# EAGLE design new_PowerBoard (EAGLE 5.11)
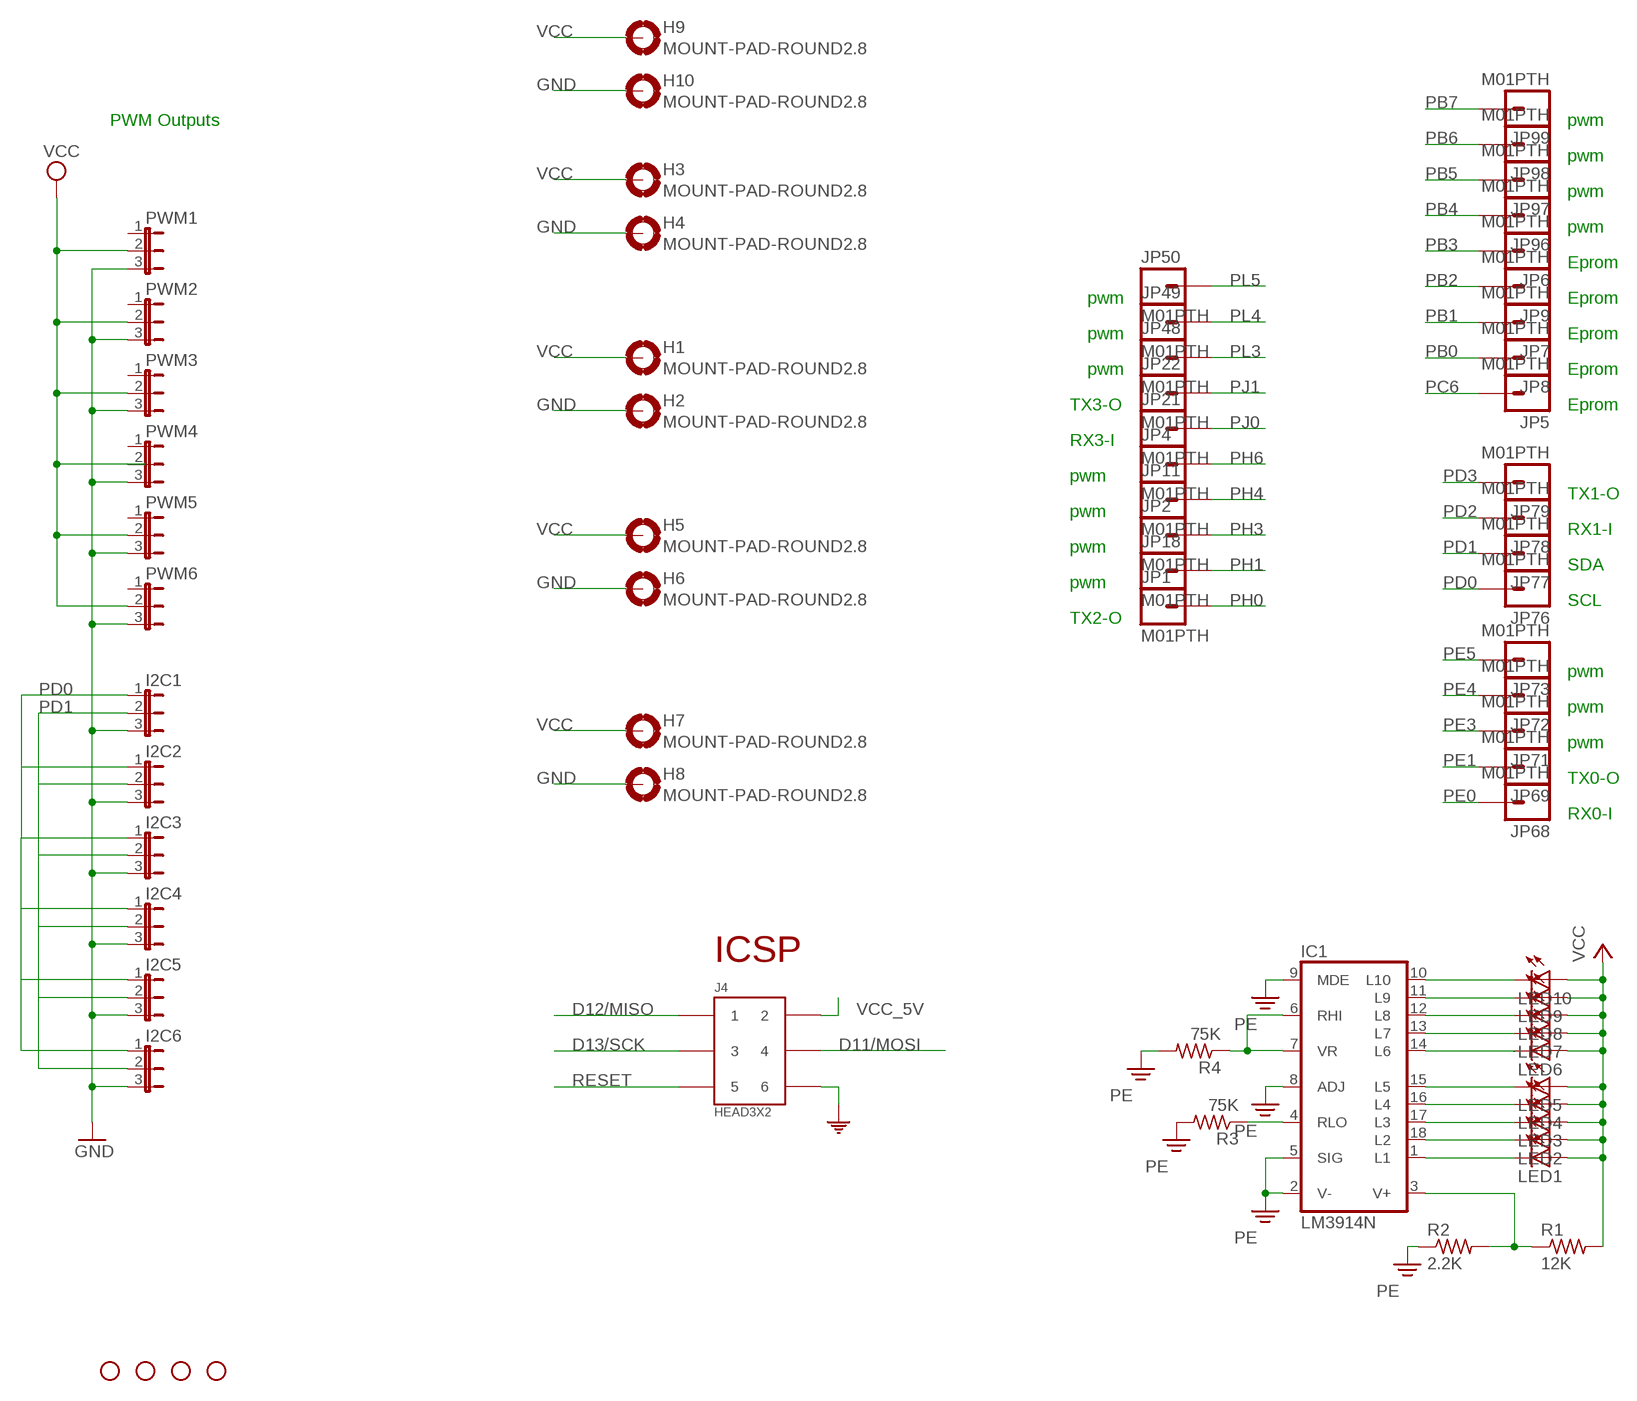
[diagram p0: schematic, sheet 1]

## Parts
H1  MOUNT-PAD-ROUND2.8  [2,8-PAD]
H2  MOUNT-PAD-ROUND2.8  [2,8-PAD]
H3  MOUNT-PAD-ROUND2.8  [2,8-PAD]
H4  MOUNT-PAD-ROUND2.8  [2,8-PAD]
H5  MOUNT-PAD-ROUND2.8  [2,8-PAD]
H6  MOUNT-PAD-ROUND2.8  [2,8-PAD]
H7  MOUNT-PAD-ROUND2.8  [2,8-PAD]
H8  MOUNT-PAD-ROUND2.8  [2,8-PAD]
H9  MOUNT-PAD-ROUND2.8  [2,8-PAD]
H10  MOUNT-PAD-ROUND2.8  [2,8-PAD]
I2C1  JP2E  [JP2]
I2C2  JP2E  [JP2]
I2C3  JP2E  [JP2]
I2C4  JP2E  [JP2]
I2C5  JP2E  [JP2]
I2C6  JP2E  [JP2]
IC1  LM3914N  [DIL18]
J4  HEAD3X2  [HEAD3X2]
JP1  M01PTH  [1X01]
JP2  M01PTH  [1X01]
JP4  M01PTH  [1X01]
JP5  M01PTH  [1X01]
JP6  M01PTH  [1X01]
JP7  M01PTH  [1X01]
JP8  M01PTH  [1X01]
JP9  M01PTH  [1X01]
JP11  M01PTH  [1X01]
JP12  STAND-OFF  [STAND-OFF]
JP13  STAND-OFF  [STAND-OFF]
JP14  STAND-OFF  [STAND-OFF]
JP15  STAND-OFF  [STAND-OFF]
JP18  M01PTH  [1X01]
JP21  M01PTH  [1X01]
JP22  M01PTH  [1X01]
JP48  M01PTH  [1X01]
JP49  M01PTH  [1X01]
JP50  M01PTH  [1X01]
JP68  M01PTH  [1X01]
JP69  M01PTH  [1X01]
JP71  M01PTH  [1X01]
JP72  M01PTH  [1X01]
JP73  M01PTH  [1X01]
JP76  M01PTH  [1X01]
JP77  M01PTH  [1X01]
JP78  M01PTH  [1X01]
JP79  M01PTH  [1X01]
JP96  M01PTH  [1X01]
JP97  M01PTH  [1X01]
JP98  M01PTH  [1X01]
JP99  M01PTH  [1X01]
LED1  LEDSMT1206  [1206]
LED2  LEDSMT1206  [1206]
LED3  LEDSMT1206  [1206]
LED4  LEDSMT1206  [1206]
LED5  LEDSMT1206  [1206]
LED6  LEDSMT1206  [1206]
LED7  LEDSMT1206  [1206]
LED8  LEDSMT1206  [1206]
LED9  LEDSMT1206  [1206]
LED10  LEDSMT1206  [1206]
PWM1  JP2E  [JP2]
PWM2  JP2E  [JP2]
PWM3  JP2E  [JP2]
PWM4  JP2E  [JP2]
PWM5  JP2E  [JP2]
PWM6  JP2E  [JP2]
R1  12K  R-US_R0805  [R0805]
R2  2.2K  R-US_R0805  [R0805]
R3  75K  R-US_R0805  [R0805]
R4  75K  R-US_R0805  [R0805]

## Nets
D11/MOSI: J4.4
D12/MISO: J4.1
D13/SCK: J4.3
GND: H2.B2,8(MOUNT) H4.B2,8(MOUNT) H6.B2,8(MOUNT) H8.B2,8(MOUNT) H10.B2,8(MOUNT) I2C1.3 I2C2.3 I2C3.3 I2C4.3 I2C5.3 I2C6.3 J4.6 PWM1.3 PWM2.3 PWM3.3 PWM4.3 PWM5.3 PWM6.3 ; supply symbol labelled COM
N$1: IC1.3(V+) R1.1 R2.2
N$2: IC1.10(L10) LED10.C
N$3: IC1.11(L9) LED9.C
N$4: IC1.12(L8) LED8.C
N$5: IC1.13(L7) LED7.C
N$7: IC1.14(L6) LED6.C
N$8: IC1.15(L5) LED5.C
N$9: IC1.16(L4) LED4.C
N$10: IC1.17(L3) LED3.C
N$11: IC1.18(L2) LED2.C
N$12: IC1.1(L1) LED1.C
N$14: IC1.4(RLO) R3.1
N$15: IC1.6(RHI) IC1.7(VR) R4.1
PB0: JP8.1
PB1: JP7.1
PB2: JP9.1
PB3: JP6.1
PB4: JP96.1
PB5: JP97.1
PB6: JP98.1
PB7: JP99.1
PC6: JP5.1
PD0: I2C1.1 I2C2.1 I2C3.1 I2C4.1 I2C5.1 I2C6.1 JP76.1
PD1: I2C1.2 I2C2.2 I2C3.2 I2C4.2 I2C5.2 I2C6.2 JP77.1
PD2: JP78.1
PD3: JP79.1
PE: IC1.2(V-) IC1.5(SIG) IC1.8(ADJ) IC1.9(MDE) R2.1 R3.2 R4.2
PE0: JP68.1
PE1: JP69.1
PE3: JP71.1
PE4: JP72.1
PE5: JP73.1
PH0: JP1.1
PH1: JP18.1
PH3: JP2.1
PH4: JP11.1
PH6: JP4.1
PJ0: JP21.1
PJ1: JP22.1
PL3: JP48.1
PL4: JP49.1
PL5: JP50.1
RESET: J4.5
VCC: H1.B2,8(MOUNT) H3.B2,8(MOUNT) H5.B2,8(MOUNT) H7.B2,8(MOUNT) H9.B2,8(MOUNT) LED1.A LED2.A LED3.A LED4.A LED5.A LED6.A LED7.A LED8.A LED9.A LED10.A PWM1.2 PWM2.2 PWM3.2 PWM5.2 PWM6.2 R1.2
VCC_5V: J4.2
Unconnected: PWM1.1 PWM2.1 PWM3.1 PWM4.1 PWM4.2 PWM5.1 PWM6.1

## Notes on the sheet
- PWM Outputs | pwm
- pwm
- pwm
- pwm
- Eprom
- pwm | Eprom
- pwm | Eprom
- pwm | Eprom
- TX3-O | Eprom
- RX3-I
- pwm
- TX1-O
- pwm
- RX1-I
- pwm
- SDA
- pwm
- SCL
- TX2-O
- pwm
- pwm
- pwm
- TX0-O
- RX0-I
- ICSP

## Library data of the parts
H1-H10 = holes:MOUNT-PAD-ROUND: MOUNTING PAD, round
I2C1-I2C6 PWM1-PWM6 = jumper:JP2E: JUMPER
IC1 = linear:LM3914N: LED DRIVER senses analog voltage levels and drives 10 LEDs
J4 = MyCON2:HEAD3X2
JP1 JP2 JP4-JP9 JP11 JP18 JP21 JP22 JP48-JP50 JP68 JP69 JP71-JP73 JP76-JP79 JP96-JP99 = DIYdrones3:M01: Header 1 Standard 1-pin 0.1" header. Use with straight break away headers (SKU : PRT-00116), right angle break away headers (PRT-00553), swiss pins (PRT-00743), machine pins (PRT-00117), and female headers (PRT-00115).
JP12-JP15 = SparkFun:STAND-OFF: Stand Off This is the mechanical footprint for a #4 phillips button head screw. Use the keepout ring to avoid running the screw head into surrounding components. SKU : PRT-00447
LED1-LED10 = led:LED: LED OSRAM: - CHIPLED LG R971, LG N971, LY N971, LG Q971, LY Q971, LO R971, LY R971 LH N974, LH R974 LS Q976, LO Q976, LY Q976 LO Q996 - Hyper CHIPLED LW Q18S LB Q993, LB Q99A, LB R99A - SideLED LS A670, LO A670, LY A670, LG A670, LP A670 LB A673, LV A673, LT A673, LW A673 LH A674 LY A675 LS A676, LA A676, LO A676, LY A676, LW A676 LS A679, LY A679, LG A679 - Hyper Micro SIDELED® LS Y876, LA Y876, LO Y876, LY Y876 LT Y87S - SmartLED LW L88C, LW L88S LB L89C, LB L89S, LG L890 LS L89K, LO L89K, LY L89K LS L896, LA L896, LO L896, LY L896 - TOPLED LS T670, LO T670, LY T670, LG T670, LP T670 LSG T670, LSP T670, LSY T670, LOP T670, LYG T670 LG T671, LOG T671, LSG T671 LB T673, LV T673, LT T673, LW T673 LH T674 LS T676, LA T676, LO T676, LY T676, LB T676, LH T676, LSB T676, LW T676 LB T67C, LV T67C, LT T67C, LS T67K, LO T67K, LY T67K, LW E67C LS E67B, LA E67B, LO E67B, LY E67B, LB E67C, LV E67C, LT E67C LW T67C LS T679, LY T679, LG T679 LS T770, LO T770, LY T770, LG T770, LP T770 LB T773, LV T773, LT T773, LW T773 LH T774 LS E675, LA E675, LY E675, LS T675 LS T776, LA T776, LO T776, LY T776, LB T776 LHGB T686 LT T68C, LB T68C - Hyper Mini TOPLED® LB M676 - Mini TOPLED Santana® LG M470 LS M47K, LO M47K, LY M47K Source: http://www.osram.convergy.de LUXEON: - LUMILED® LXK2-PW12-R00, LXK2-PW12-S00, LXK2-PW14-U00, LXK2-PW14-V00 LXK2-PM12-R00, LXK2-PM12-S00, LXK2-PM14-U00 LXK2-PE12-Q00, LXK2-PE12-R00, LXK2-PE12-S00, LXK2-PE14-T00, LXK2-PE14-U00 LXK2-PB12-K00, LXK2-PB12-L00, LXK2-PB12-M00, LXK2-PB14-N00, LXK2-PB14-P00, LXK2-PB14-Q00 LXK2-PR12-L00, LXK2-PR12-M00, LXK2-PR14-Q00, LXK2-PR14-R00 LXK2-PD12-Q00, LXK2-PD12-R00, LXK2-PD12-S00 LXK2-PH12-R00, LXK2-PH12-S00 LXK2-PL12-P00, LXK2-PL12-Q00, LXK2-PL12-R00 Source: www.luxeon.com KINGBRIGHT: KA-3528ASYC Source: www.kingbright.com
R1-R4 = resistor:R-US_: RESISTOR, American symbol

## Board
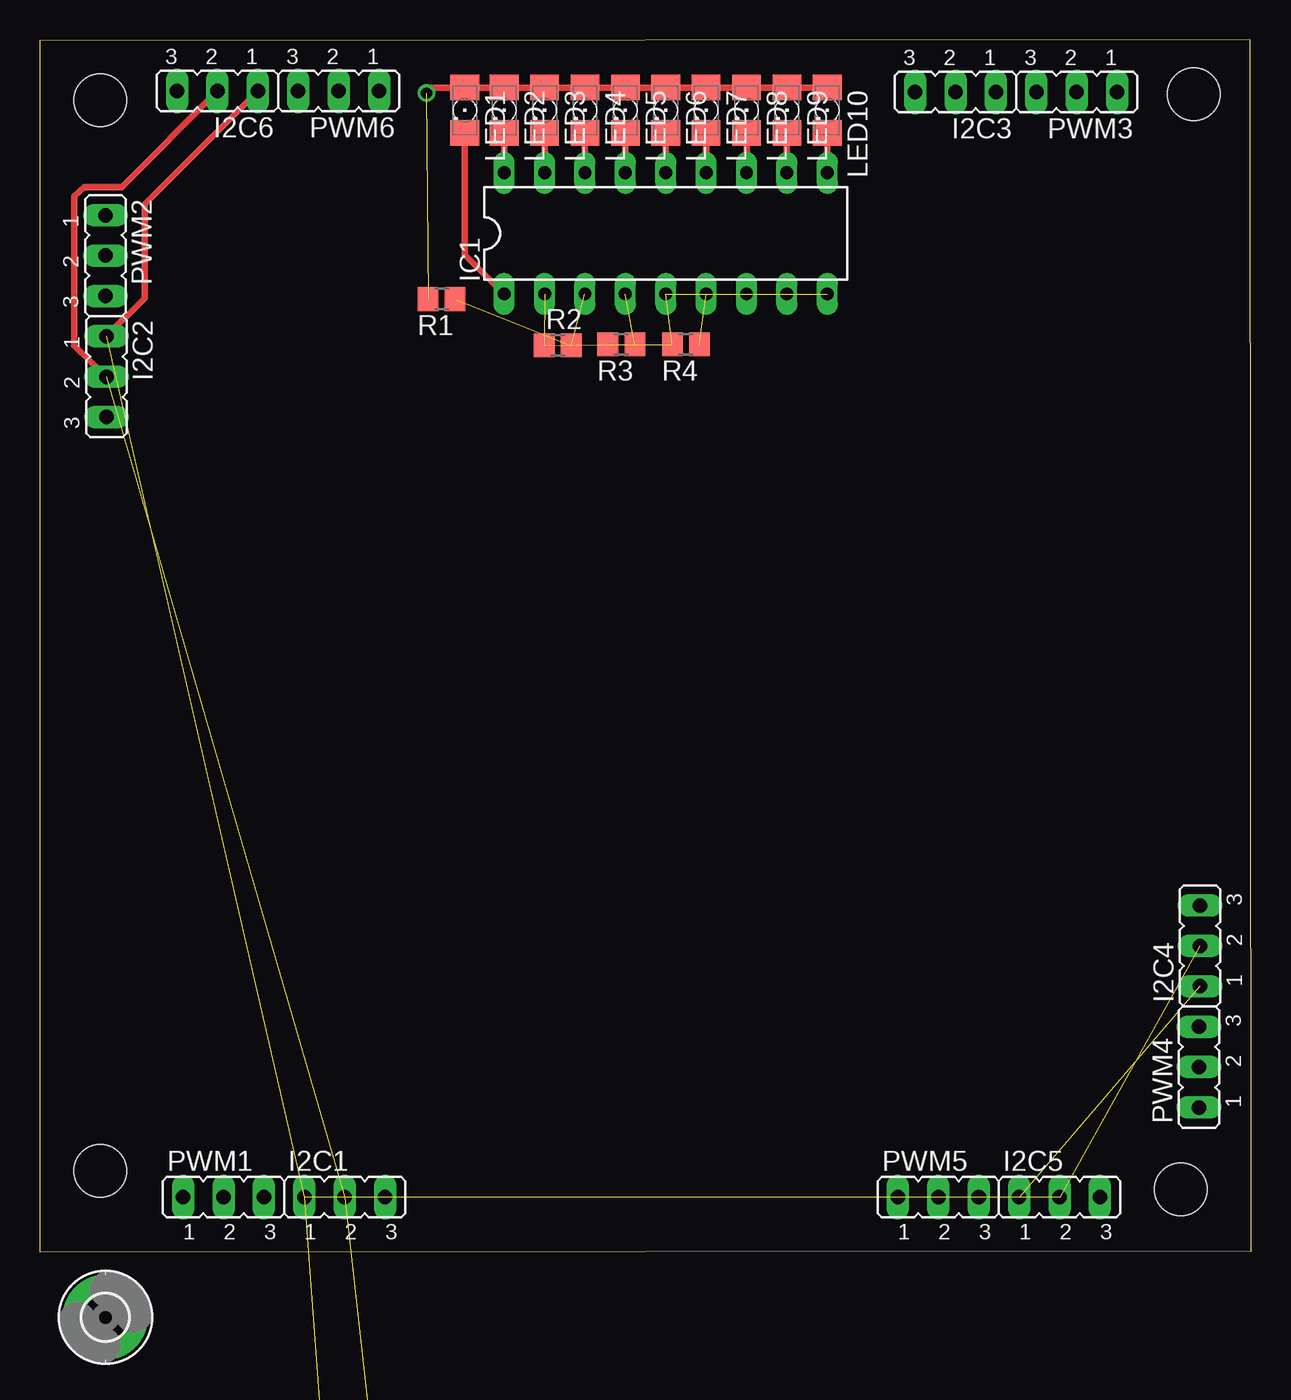
[diagram p1: board, top side]
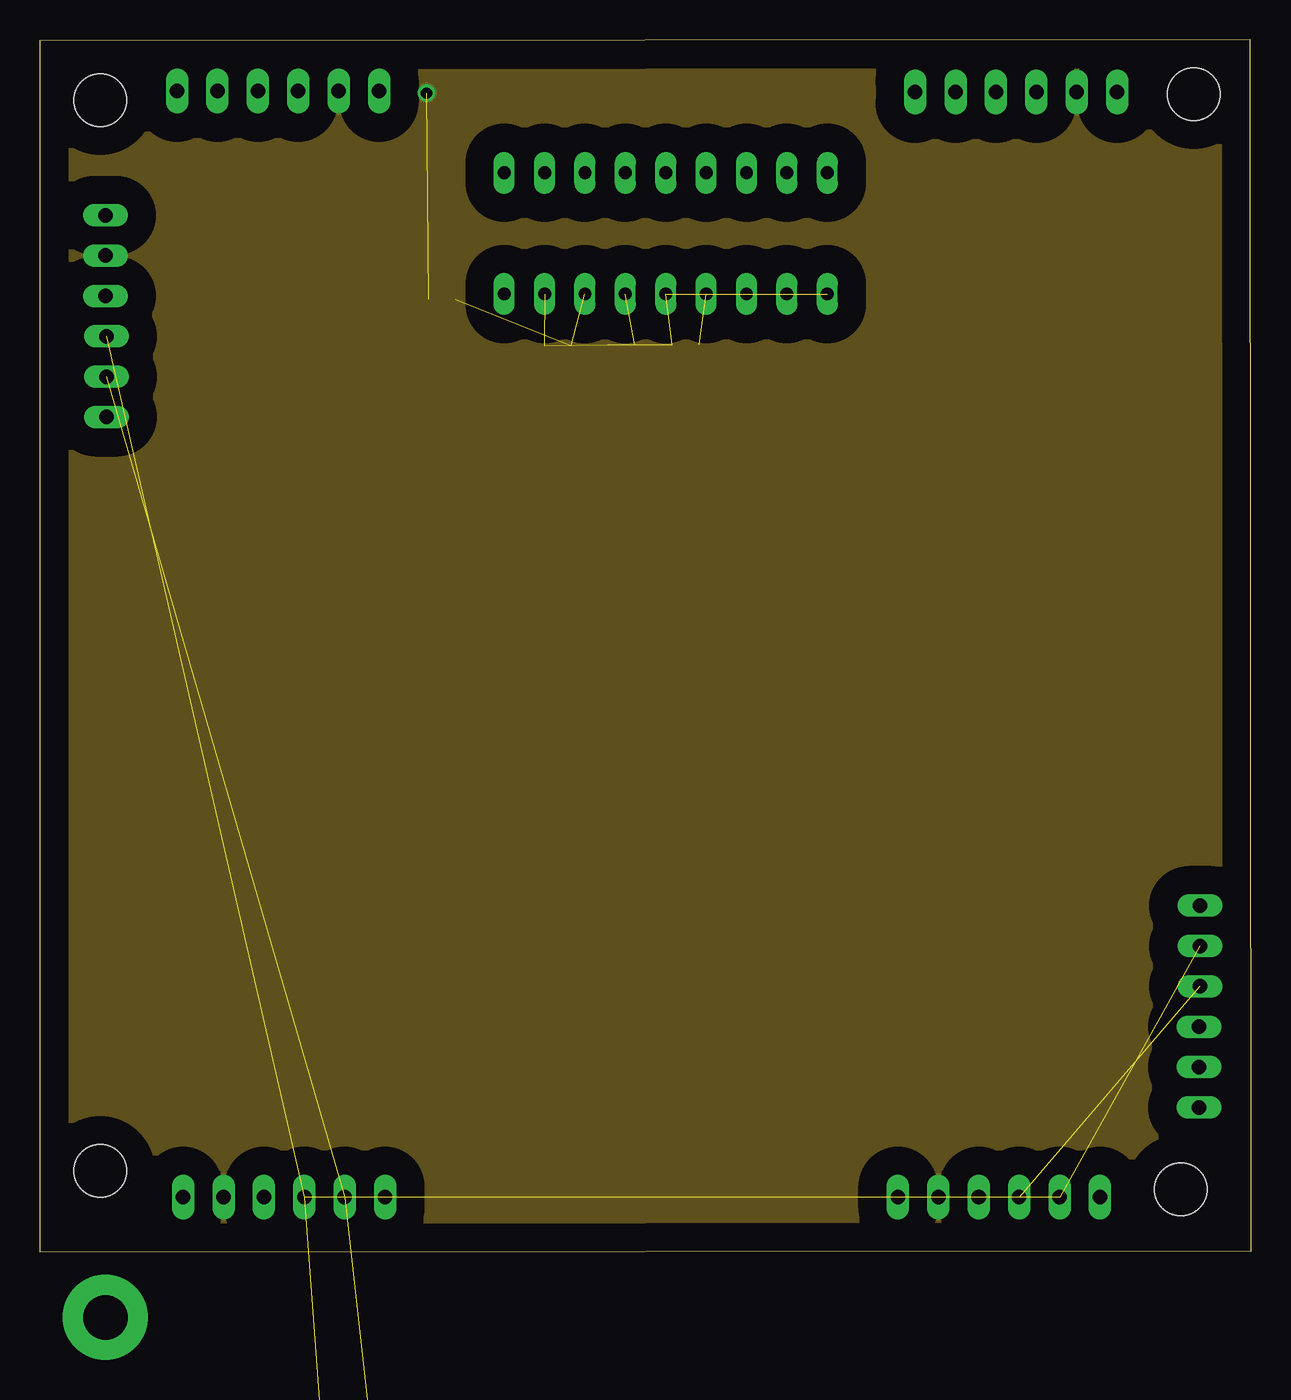
[diagram p2: board, inner layer $vcc]
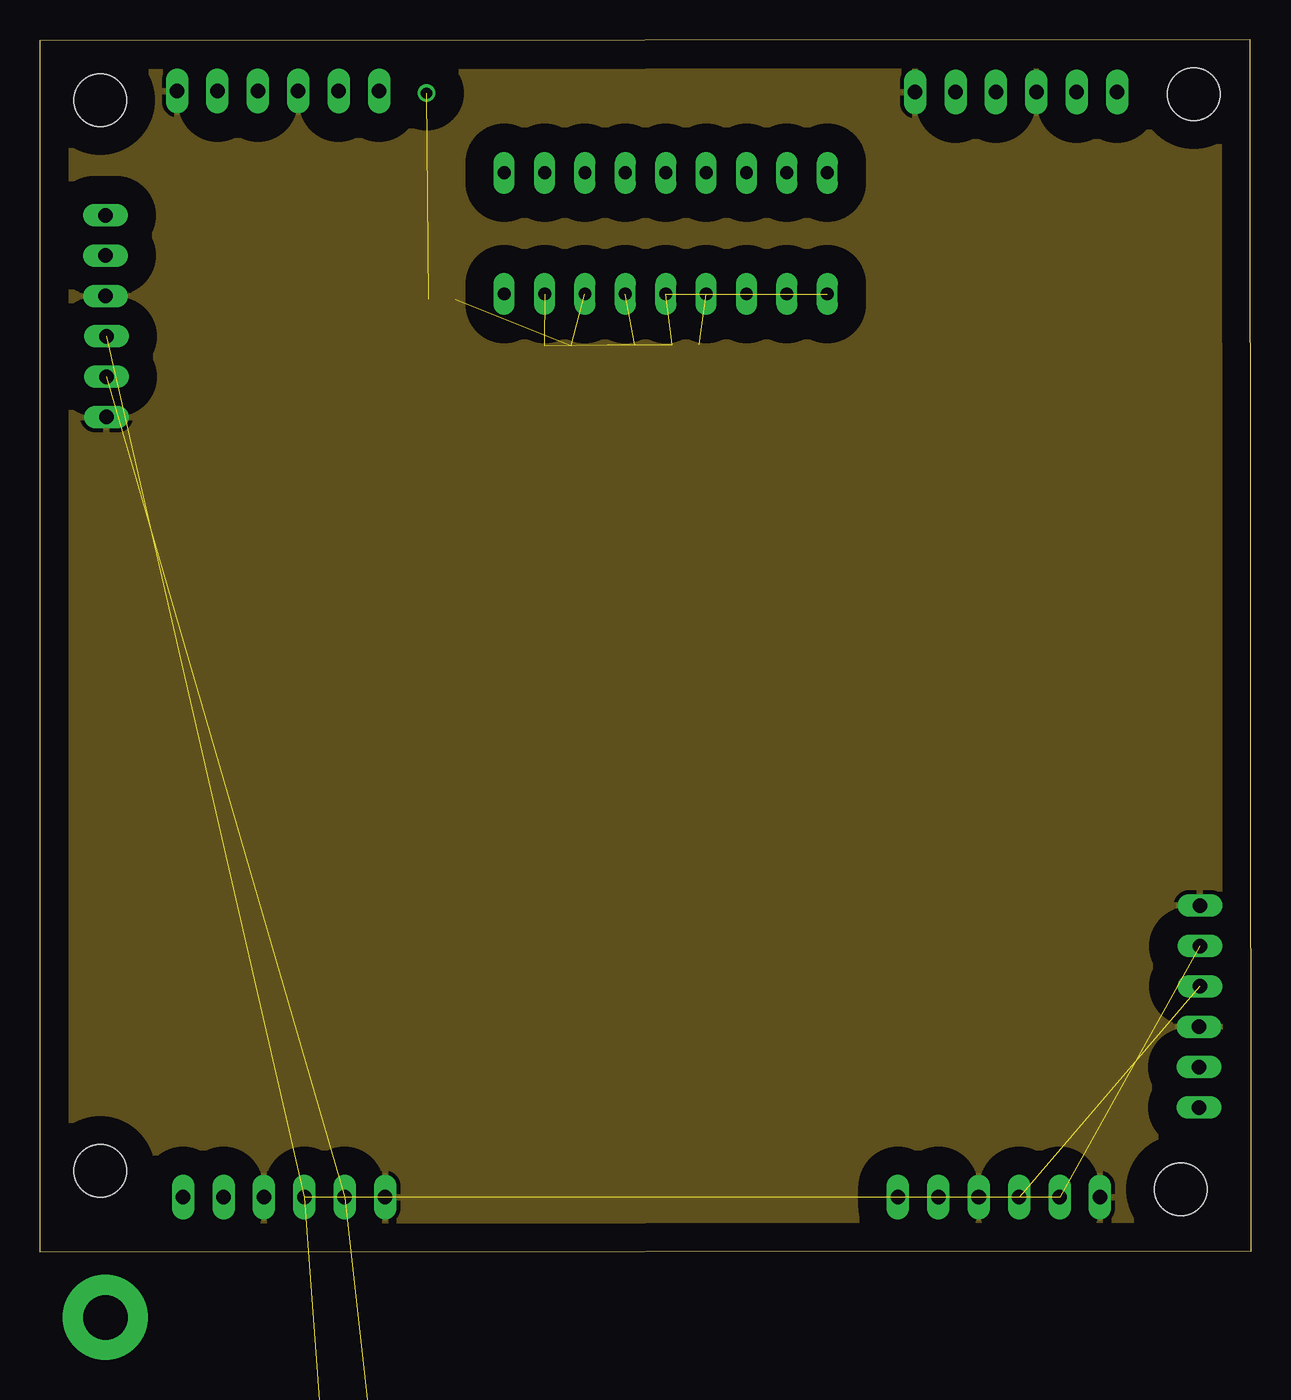
[diagram p3: board, inner layer $gnd]
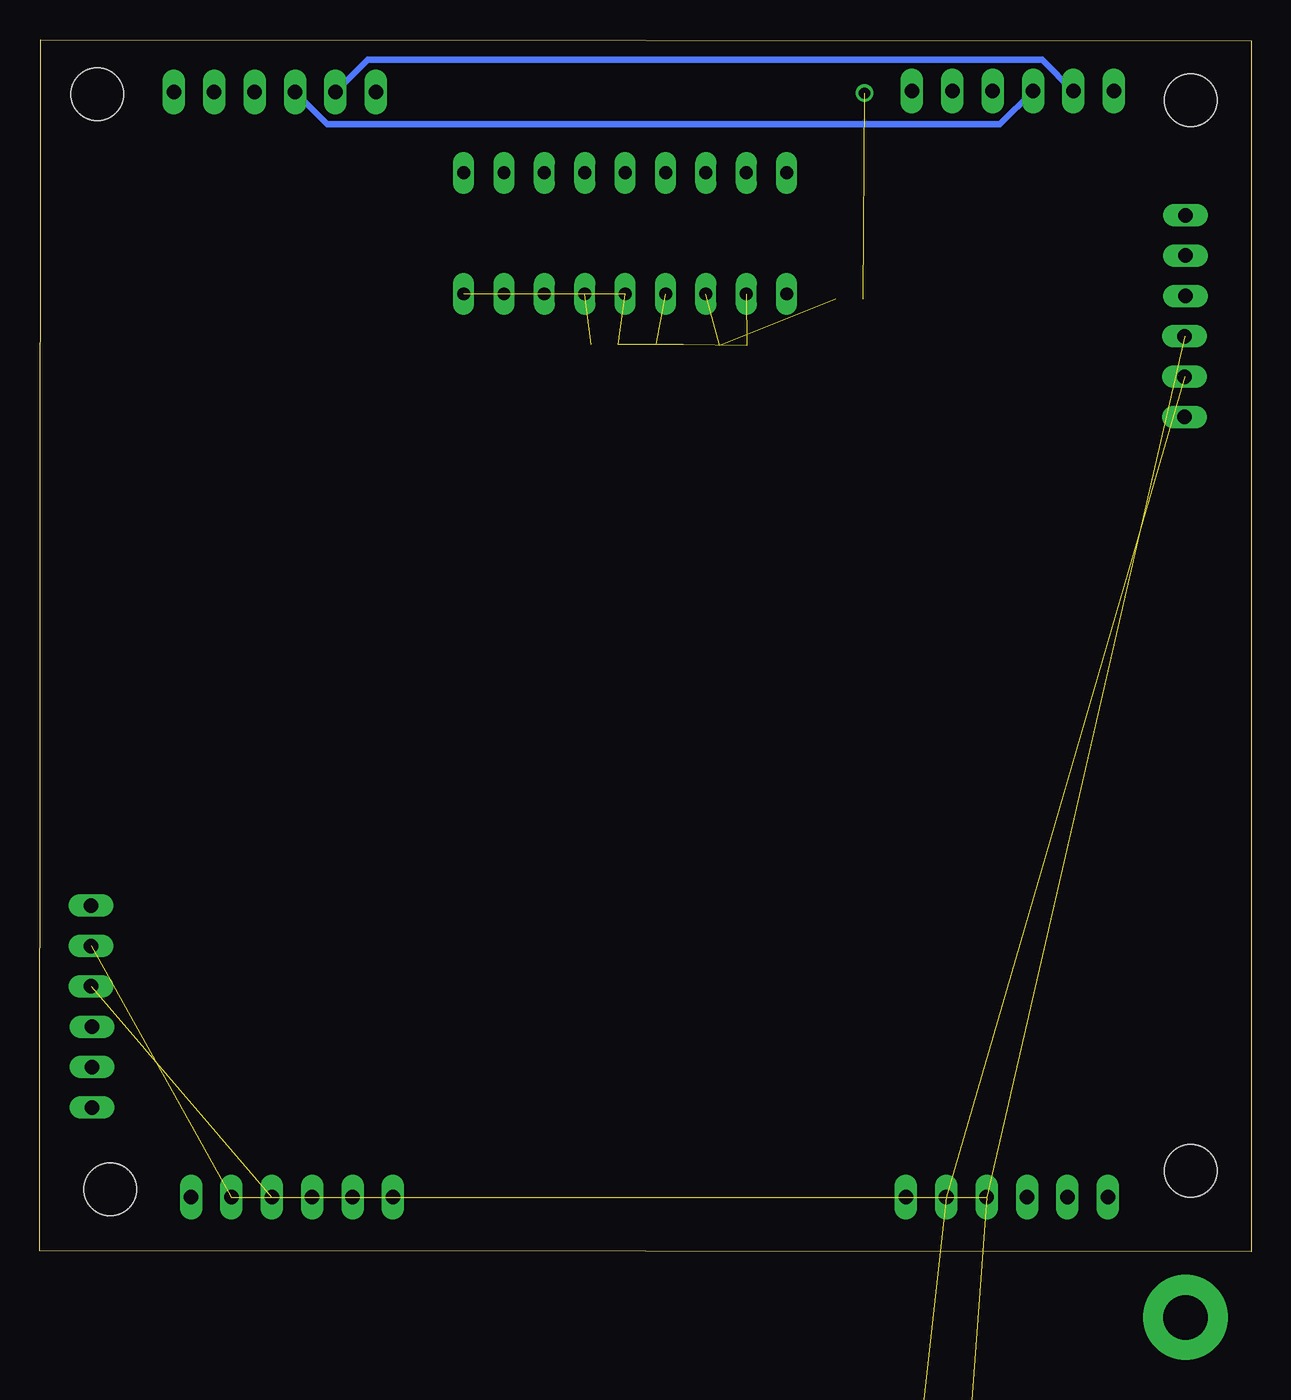
[diagram p4: board, bottom side, seen from below]

Size 76.19 x 76.25 mm. Coordinates in mm from the lower left corner, seen from the top.
Outline: 0,0 76.19,0.06 76.12,76.25 0,76.19 0,0
Copper layers (1*16): Top 0.0356mm / dielectric 1.5011mm / Bottom 0.0356mm
Design rules "typical_4pcb": minimum track width 10mil, minimum drill 15mil, track to track 6mil, track to pad 6mil, pad to pad 6mil, via to via 6mil, smd to smd 6mil, copper to edge 15mil, drill to drill 8mil, minimum pad ring 10mil, minimum via ring 8mil, stop-mask expansion 4mil, vias tented up to drill 0mil, thermal gap 10mil

### Footprints (pad centres in the part's own frame; a part is rotated, then mirrored left to right if it is on the bottom)
2,8-PAD = drill 2.8 pad 5.334 round: B2,8 0,0
JP2 = drill 0.914 long: 1 -2.54,0; 2 0,0; 3 2.54,0
DIL18 = drill 0.813 long: 1 -10.16,-3.81; 2 -7.62,-3.81; 3 -5.08,-3.81; 4 -2.54,-3.81; 5 0,-3.81; 6 2.54,-3.81; 7 5.08,-3.81; 8 7.62,-3.81; 9 10.16,-3.81; 10 10.16,3.81; 11 7.62,3.81; 12 5.08,3.81; 13 2.54,3.81; 14 0,3.81; 15 -2.54,3.81; 16 -5.08,3.81; 17 -7.62,3.81; 18 -10.16,3.81
HEAD3X2 = drill 0.914 pad 1.778 square: 1 0,0 | drill 0.914 pad 1.778 round: 2 0,2.54; 3 2.54,0; 4 2.54,2.54; 5 5.08,0; 6 5.08,2.54
1X01 = drill 1.016 round: 1 0,0
STAND-OFF = hole 3.302: 0,0
1206 = smd 1.6 x 1.803: A -1.422,0; C 1.422,0
R0805 = smd 1.3 x 1.5: 1 -0.85,0; 2 0.85,0

### Placement (x,y rotation side)
H1  4.13,-20.13 0 top  (outside the outline)
H2  4.13,-28.38 0 top  (outside the outline)
H3  4.13,-4.13 0 top  (outside the outline)
H4  4.13,-12.38 0 top  (outside the outline)
H5  4.13,-36.13 0 top  (outside the outline)
H6  4.13,-44.39 0 top  (outside the outline)
H7  4.13,-52.13 0 top  (outside the outline)
H8  4.13,-60.39 0 top  (outside the outline)
H9  4.13,-68.14 0 top  (outside the outline)
H10  4.13,-76.39 0 top  (outside the outline)
I2C1  19.18,3.43 0 top
I2C2  4.19,55.05 270 top
I2C3  57.59,72.96 180 top
I2C4  72.96,19.24 90 top
I2C5  64.14,3.43 0 top
I2C6  11.18,73.03 180 top
IC1  39.37,64.07 0 top
J4  -6.79,-88.52 0 top  (outside the outline)
JP1  2.48,-146.24 0 top  (outside the outline)
JP2  11.49,-146.24 0 top  (outside the outline)
JP4  29.59,-146.24 0 top  (outside the outline)
JP5  38.61,-146.24 0 top  (outside the outline)
JP6  47.62,-146.24 0 top  (outside the outline)
JP7  2.48,-154.5 0 top  (outside the outline)
JP8  11.49,-154.5 0 top  (outside the outline)
JP9  20.51,-154.43 0 top  (outside the outline)
JP11  29.53,-154.43 0 top  (outside the outline)
JP12  3.81,5.08 0 top
JP13  3.81,72.45 0 top
JP14  72.58,72.83 0 top
JP15  71.75,3.94 0 top
JP18  38.54,-154.5 0 top  (outside the outline)
JP21  47.62,-154.5 0 top  (outside the outline)
JP22  2.48,-162.69 0 top  (outside the outline)
JP48  11.49,-162.75 0 top  (outside the outline)
JP49  20.51,-162.75 0 top  (outside the outline)
JP50  29.53,-162.69 0 top  (outside the outline)
JP68  38.54,-162.69 0 top  (outside the outline)
JP69  47.56,-162.75 0 top  (outside the outline)
JP71  2.48,-171.01 0 top  (outside the outline)
JP72  11.49,-170.94 0 top  (outside the outline)
JP73  20.51,-171.01 0 top  (outside the outline)
JP76  29.53,-171.01 0 top  (outside the outline)
JP77  38.54,-170.94 0 top  (outside the outline)
JP78  47.56,-170.94 0 top  (outside the outline)
JP79  2.48,-179.26 0 top  (outside the outline)
JP96  11.49,-179.26 0 top  (outside the outline)
JP97  20.51,-179.2 0 top  (outside the outline)
JP98  29.53,-179.26 0 top  (outside the outline)
JP99  38.54,-179.26 0 top  (outside the outline)
LED1  26.73,71.82 270 top
LED2  29.21,71.82 270 top
LED3  31.75,71.82 270 top
LED4  34.29,71.82 270 top
LED5  36.83,71.82 270 top
LED6  39.37,71.82 270 top
LED7  41.91,71.82 270 top
LED8  44.45,71.82 270 top
LED9  46.99,71.82 270 top
LED10  49.53,71.82 270 top
PWM1  11.56,3.43 0 top
PWM2  4.13,62.67 270 top
PWM3  65.21,72.96 180 top
PWM4  72.9,11.62 90 top
PWM5  56.52,3.43 0 top
PWM6  18.8,73.03 180 top
R1  25.27,59.94 180 top
R2  32.58,57.02 0 top
R3  36.58,57.09 180 top
R4  40.64,57.09 180 top

### Tracks (layer width: path | path; a pad name or v marks a point on that pad's centre or on a via)
GND
  pour $gnd (isolate 1.778): 1.46,75.25 75.06,75.25 74.61,0.83 1.02,0.83
N$1  (2 unrouted)
N$2
  Top 0.406: IC1.10 LED10.C
N$3
  Top 0.406: IC1.11 LED9.C
N$4
  Top 0.406: IC1.12 LED8.C
N$5
  Top 0.406: IC1.13 LED7.C
N$7
  Top 0.406: IC1.14 LED6.C
N$8
  Top 0.406: IC1.15 LED5.C
N$9
  Top 0.406: IC1.16 LED4.C
N$10
  Top 0.406: IC1.17 LED3.C
N$11
  Top 0.406: IC1.18 LED2.C
N$12
  Top 0.406: LED1.C 26.73,62.74 IC1.1
N$14  (1 unrouted)
N$15  (2 unrouted)
PD0  (4 unrouted)
  Top 0.406: I2C6.1 6.6,65.91 6.6,60.01 I2C2.1
  Bottom 0.406: I2C3.1 58.1,70.93 15.81,70.93 I2C6.1
PD1  (4 unrouted)
  Top 0.406: I2C6.2 5.14,66.99 2.79,66.99 2.16,66.42 2.16,57.02 I2C2.2
  Bottom 0.406: I2C3.2 55.56,74.99 13.14,74.99 I2C6.2
PE  (6 unrouted)
VCC  (via drill 0.7)  (1 unrouted)
  Top 0.406: LED10.A LED9.A LED8.A LED7.A LED6.A LED5.A LED4.A LED3.A LED2.A LED1.A 24.66,73.24 v24.32,72.9
  pour $vcc (isolate 1.778): 1.33,75.18 75.18,75.44 74.68,0.83 1.02,0.89